# EAGLE design diy-ltcc (EAGLE 9.0.1)
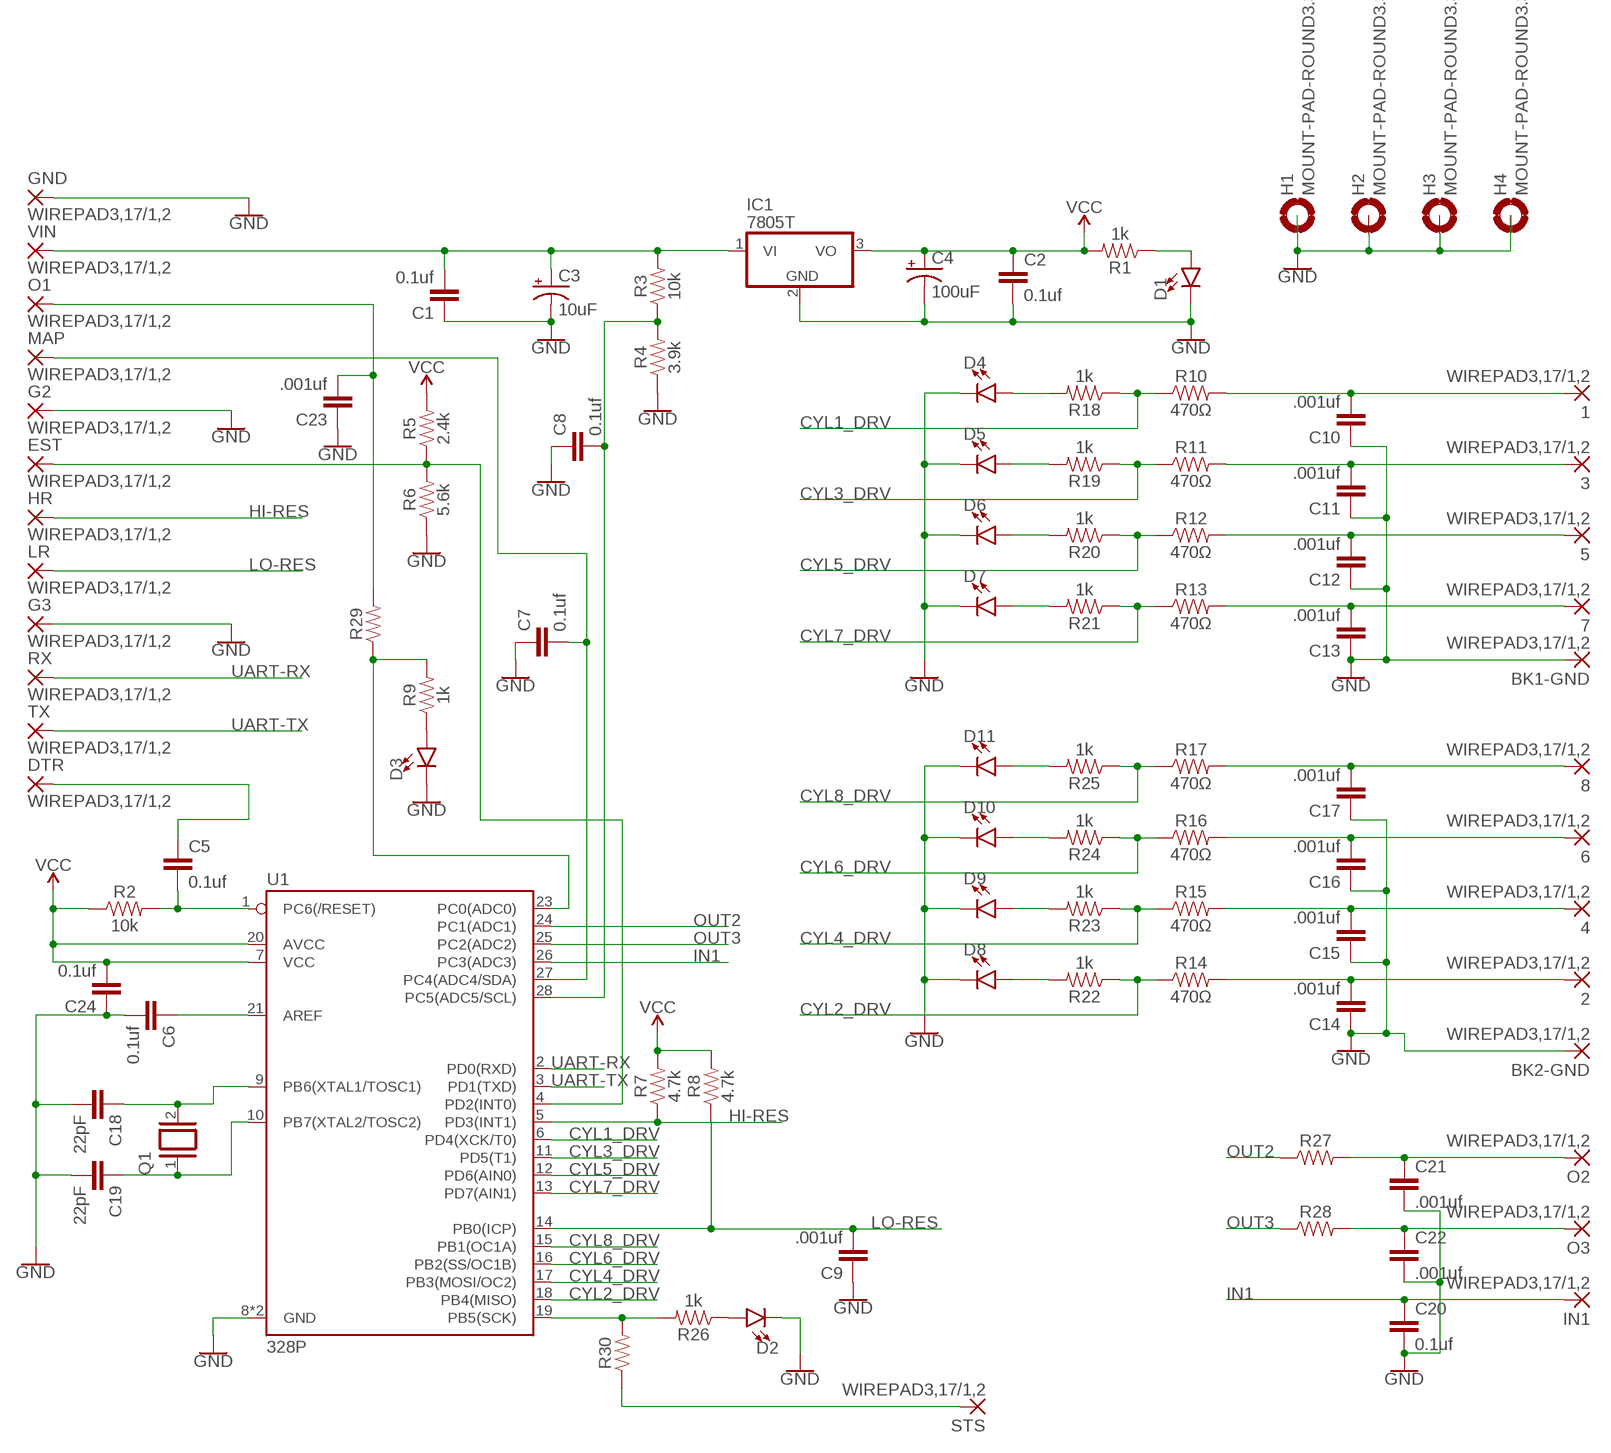
[diagram p0: schematic, sheet 1]

## Parts
1  WIREPAD3,17/1,2  [3,17/1,2]
2  WIREPAD3,17/1,2  [3,17/1,2]
3  WIREPAD3,17/1,2  [3,17/1,2]
4  WIREPAD3,17/1,2  [3,17/1,2]
5  WIREPAD3,17/1,2  [3,17/1,2]
6  WIREPAD3,17/1,2  [3,17/1,2]
7  WIREPAD3,17/1,2  [3,17/1,2]
8  WIREPAD3,17/1,2  [3,17/1,2]
BK1-GND  WIREPAD3,17/1,2  [3,17/1,2]
BK2-GND  WIREPAD3,17/1,2  [3,17/1,2]
C1  0.1uf  22PF-PTH-2.54MM-200V-5%  [CAP-PTH-2.54]
C2  0.1uf  22PF-PTH-2.54MM-200V-5%  [CAP-PTH-2.54]
C3  10uF  10UF-POLAR-RADIAL-2.5MM-KIT-25V-20%  [CPOL-RADIAL-2.5MM-5MM-KIT]
C4  100uF  100UF-POLAR-RADIAL-2.5MM-25V-20%  [CPOL-RADIAL-2.5MM-6.5MM]
C5  0.1uf  22PF-PTH-2.54MM-200V-5%  [CAP-PTH-2.54]
C6  0.1uf  22PF-PTH-2.54MM-200V-5%  [CAP-PTH-2.54]
C7  0.1uf  22PF-PTH-2.54MM-200V-5%  [CAP-PTH-2.54]
C8  0.1uf  22PF-PTH-2.54MM-200V-5%  [CAP-PTH-2.54]
C9  .001uf  22PF-PTH-2.54MM-200V-5%  [CAP-PTH-2.54]
C10  .001uf  22PF-PTH-2.54MM-200V-5%  [CAP-PTH-2.54]
C11  .001uf  22PF-PTH-2.54MM-200V-5%  [CAP-PTH-2.54]
C12  .001uf  22PF-PTH-2.54MM-200V-5%  [CAP-PTH-2.54]
C13  .001uf  22PF-PTH-2.54MM-200V-5%  [CAP-PTH-2.54]
C14  .001uf  22PF-PTH-2.54MM-200V-5%  [CAP-PTH-2.54]
C15  .001uf  22PF-PTH-2.54MM-200V-5%  [CAP-PTH-2.54]
C16  .001uf  22PF-PTH-2.54MM-200V-5%  [CAP-PTH-2.54]
C17  .001uf  22PF-PTH-2.54MM-200V-5%  [CAP-PTH-2.54]
C18  22pF  22PF-PTH-2.54MM-200V-5%  [CAP-PTH-2.54]
C19  22pF  22PF-PTH-2.54MM-200V-5%  [CAP-PTH-2.54]
C20  0.1uf  22PF-PTH-2.54MM-200V-5%  [CAP-PTH-2.54]
C21  .001uf  22PF-PTH-2.54MM-200V-5%  [CAP-PTH-2.54]
C22  .001uf  22PF-PTH-2.54MM-200V-5%  [CAP-PTH-2.54]
C23  .001uf  22PF-PTH-2.54MM-200V-5%  [CAP-PTH-2.54]
C24  0.1uf  22PF-PTH-2.54MM-200V-5%  [CAP-PTH-2.54]
D1  LED3MM  [LED_3MM]
D2  LED3MM  [LED_3MM]
D3  LED3MM  [LED_3MM]
D4  LED3MM  [LED_3MM]
D5  LED3MM  [LED_3MM]
D6  LED3MM  [LED_3MM]
D7  LED3MM  [LED_3MM]
D8  LED3MM  [LED_3MM]
D9  LED3MM  [LED_3MM]
D10  LED3MM  [LED_3MM]
D11  LED3MM  [LED_3MM]
DTR  WIREPAD3,17/1,2  [3,17/1,2]
EST  WIREPAD3,17/1,2  [3,17/1,2]
G2  WIREPAD3,17/1,2  [3,17/1,2]
G3  WIREPAD3,17/1,2  [3,17/1,2]
GND  WIREPAD3,17/1,2  [3,17/1,2]
H1  MOUNT-PAD-ROUND3.3  [3,3-PAD]
H2  MOUNT-PAD-ROUND3.3  [3,3-PAD]
H3  MOUNT-PAD-ROUND3.3  [3,3-PAD]
H4  MOUNT-PAD-ROUND3.3  [3,3-PAD]
HR  WIREPAD3,17/1,2  [3,17/1,2]
IC1  7805T  [TO220H]
IN1  WIREPAD3,17/1,2  [3,17/1,2]
LR  WIREPAD3,17/1,2  [3,17/1,2]
MAP  WIREPAD3,17/1,2  [3,17/1,2]
O1  WIREPAD3,17/1,2  [3,17/1,2]
O2  WIREPAD3,17/1,2  [3,17/1,2]
O3  WIREPAD3,17/1,2  [3,17/1,2]
Q1  XTAL/S  [QS]
R1  1k  1KOHM-HORIZ-1/4W-5%  [AXIAL-0.3]
R2  10k  10KOHM-HORIZ-1/4W-5%  [AXIAL-0.3]
R3  10k  10KOHM-HORIZ-1/4W-5%  [AXIAL-0.3]
R4  3.9k  10KOHM-HORIZ-1/4W-5%  [AXIAL-0.3]
R5  2.4k  1KOHM-HORIZ-1/4W-1%  [AXIAL-0.3]
R6  5.6k  1KOHM-HORIZ-1/4W-1%  [AXIAL-0.3]
R7  4.7k  10KOHM-HORIZ-1/4W-5%  [AXIAL-0.3]
R8  4.7k  10KOHM-HORIZ-1/4W-5%  [AXIAL-0.3]
R9  1k  1KOHM-HORIZ-1/4W-1%  [AXIAL-0.3]
R10  470Ω  1KOHM-HORIZ-1/4W-1%  [AXIAL-0.3]
R11  470Ω  1KOHM-HORIZ-1/4W-1%  [AXIAL-0.3]
R12  470Ω  1KOHM-HORIZ-1/4W-1%  [AXIAL-0.3]
R13  470Ω  1KOHM-HORIZ-1/4W-1%  [AXIAL-0.3]
R14  470Ω  1KOHM-HORIZ-1/4W-1%  [AXIAL-0.3]
R15  470Ω  1KOHM-HORIZ-1/4W-1%  [AXIAL-0.3]
R16  470Ω  1KOHM-HORIZ-1/4W-1%  [AXIAL-0.3]
R17  470Ω  1KOHM-HORIZ-1/4W-1%  [AXIAL-0.3]
R18  1k  1KOHM-HORIZ-1/4W-1%  [AXIAL-0.3]
R19  1k  1KOHM-HORIZ-1/4W-1%  [AXIAL-0.3]
R20  1k  1KOHM-HORIZ-1/4W-1%  [AXIAL-0.3]
R21  1k  1KOHM-HORIZ-1/4W-1%  [AXIAL-0.3]
R22  1k  1KOHM-HORIZ-1/4W-1%  [AXIAL-0.3]
R23  1k  1KOHM-HORIZ-1/4W-1%  [AXIAL-0.3]
R24  1k  1KOHM-HORIZ-1/4W-1%  [AXIAL-0.3]
R25  1k  1KOHM-HORIZ-1/4W-1%  [AXIAL-0.3]
R26  1k  1KOHM-HORIZ-1/4W-1%  [AXIAL-0.3]
R27  1KOHM-HORIZ-1/4W-1%  [AXIAL-0.3]
R28  1KOHM-HORIZ-1/4W-1%  [AXIAL-0.3]
R29  1KOHM-HORIZ-1/4W-1%  [AXIAL-0.3]
R30  1KOHM-HORIZ-1/4W-1%  [AXIAL-0.3]
RX  WIREPAD3,17/1,2  [3,17/1,2]
STS  WIREPAD3,17/1,2  [3,17/1,2]
TX  WIREPAD3,17/1,2  [3,17/1,2]
U1  328P  ATMEGA328P_PDIP  [DIP28]
VIN  WIREPAD3,17/1,2  [3,17/1,2]

## Nets
CYL1_DRV: R10.P$1 R18.P$1 U1.6(PD4(XCK/T0))
CYL2_DRV: R14.P$1 R22.P$1 U1.18(PB4(MISO))
CYL3_DRV: R11.P$1 R19.P$1 U1.11(PD5(T1))
CYL4_DRV: R15.P$1 R23.P$1 U1.17(PB3(MOSI/OC2))
CYL5_DRV: R12.P$1 R20.P$1 U1.12(PD6(AIN0))
CYL6_DRV: R16.P$1 R24.P$1 U1.16(PB2(SS/OC1B))
CYL7_DRV: R13.P$1 R21.P$1 U1.13(PD7(AIN1))
CYL8_DRV: R17.P$1 R25.P$1 U1.15(PB1(OC1A))
DTR: C5.1 DTR.1(P)
GND: BK1-GND.1(P) BK2-GND.1(P) C1.1 C2.2 C3.2(-) C4.2(-) C6.2 C7.1 C8.1 C9.1 C10.1 C11.1 C12.1 C13.1 C14.1 C15.1 C16.1 C17.1 C18.2 C19.2 C20.2 C21.2 C22.2 C23.1 C24.1 D1.K(C) D2.K(C) D3.K(C) D4.K(C) D5.K(C) D6.K(C) D7.K(C) D8.K(C) D9.K(C) D10.K(C) D11.K(C) G2.1(P) G3.1(P) GND.1(P) H1.B3,3(MOUNT) H2.B3,3(MOUNT) H3.B3,3(MOUNT) H4.B3,3(MOUNT) IC1.2(GND) R4.P$1 R6.P$1 U1.8(GND) U1.22(GND)
HI-RES: HR.1(P) R7.P$1 U1.5(PD3(INT1))
IN1: C20.1 IN1.1(P) U1.26(PC3(ADC3))
LO-RES: C9.2 LR.1(P) R8.P$1 U1.14(PB0(ICP))
N$1: D1.A R1.P$1
N$2: C5.2 R2.P$2 U1.1(PC6(/RESET))
N$3: C6.1 U1.21(AREF)
N$4: C8.2 R3.P$1 R4.P$2 U1.28(PC5(ADC5/SCL))
N$5: C1.2 C3.1(+) IC1.1(VI) R3.P$2 VIN.1(P)
N$6: C7.2 MAP.1(P) U1.27(PC4(ADC4/SDA))
N$7: EST.1(P) R5.P$1 R6.P$2 U1.4(PD2(INT0))
N$8: R9.P$2 R29.P$1 U1.23(PC0(ADC0))
N$9: D3.A R9.P$1
N$10: 7.1(P) C13.2 R13.P$2
N$11: 5.1(P) C12.2 R12.P$2
N$12: 3.1(P) C11.2 R11.P$2
N$13: 1.1(P) C10.2 R10.P$2
N$14: D2.A R26.P$1
N$15: 8.1(P) C17.2 R17.P$2
N$16: 6.1(P) C16.2 R16.P$2
N$17: 4.1(P) C15.2 R15.P$2
N$18: 2.1(P) C14.2 R14.P$2
N$19: R26.P$2 R30.P$2 U1.19(PB5(SCK))
N$20: D8.A R22.P$2
N$21: D9.A R23.P$2
N$22: D10.A R24.P$2
N$23: D11.A R25.P$2
N$24: D7.A R21.P$2
N$25: D6.A R20.P$2
N$26: D5.A R19.P$2
N$27: D4.A R18.P$2
N$28: C18.1 Q1.2 U1.9(PB6(XTAL1/TOSC1))
N$29: C19.1 Q1.1 U1.10(PB7(XTAL2/TOSC2))
N$30: C23.2 O1.1(P) R29.P$2
N$31: C22.1 O3.1(P) R28.P$2
N$32: C21.1 O2.1(P) R27.P$2
N$33: R30.P$1 STS.1(P)
OUT2: R27.P$1 U1.24(PC1(ADC1))
OUT3: R28.P$1 U1.25(PC2(ADC2))
UART-RX: RX.1(P) U1.2(PD0(RXD))
UART-TX: TX.1(P) U1.3(PD1(TXD))
VCC: C2.1 C4.1(+) C24.2 IC1.3(VO) R1.P$2 R2.P$1 R5.P$2 R7.P$2 R8.P$2 U1.7(VCC) U1.20(AVCC)

## Library data of the parts
1-8 BK1-GND BK2-GND DTR EST G2 G3 GND HR IN1 LR MAP O1-O3 RX STS TX VIN = wirepad:WIREPAD: Wire PAD connect wire on PCB
C1 C2 C5-C17 C20-C24 = SparkFun-Capacitors:22PF: 22pF ceramic capacitors A capacitor is a passive two-terminal electrical component used to store electrical energy temporarily in an electric field.; PROD_ID: CAP-09128; VALUE: 22pF
C3 = SparkFun-Capacitors:10UF-POLAR: 10.0µF polarized capacitors A capacitor is a passive two-terminal electrical component used to store electrical energy temporarily in an electric field.; PROD_ID: CAP-08440
C4 = SparkFun-Capacitors:100UF-POLAR: 100µF polarized capacitors A capacitor is a passive two-terminal electrical component used to store electrical energy temporarily in an electric field.; PROD_ID: CAP-08439
C18 C19 = SparkFun-Capacitors:22PF: 22pF ceramic capacitors A capacitor is a passive two-terminal electrical component used to store electrical energy temporarily in an electric field.; PROD_ID: CAP-09128
D1-D11 = SparkFun-LED:LED: LED (Generic) Standard schematic elements and footprints for 5mm, 3mm, 1206, and 0603 sized LEDs. Generic LEDs with no color specified.; PROD_ID: DIO-08794
H1-H4 = holes:MOUNT-PAD-ROUND: MOUNTING PAD, round
IC1 = linear:78*: Positive VOLTAGE REGULATOR Source: http://cache.national.com/ds/LM/LM78L05.pdf http://www.fairchildsemi.com/ds/LM/LM7805.pdf
Q1 = special:XTAL/S: CRYSTAL
R1 = SparkFun-Resistors:1KOHM: 1kΩ resistor A resistor is a passive two-terminal electrical component that implements electrical resistance as a circuit element. Resistors act to reduce current flow, and, at the same time, act to lower voltage levels within circuits. - Wikipedia; PROD_ID: RES-08380
R2 R3 = SparkFun-Resistors:10KOHM: 10kΩ resistor A resistor is a passive two-terminal electrical component that implements electrical resistance as a circuit element. Resistors act to reduce current flow, and, at the same time, act to lower voltage levels within circuits. - Wikipedia; PROD_ID: RES-09435
R4 R7 R8 = SparkFun-Resistors:10KOHM: 10kΩ resistor A resistor is a passive two-terminal electrical component that implements electrical resistance as a circuit element. Resistors act to reduce current flow, and, at the same time, act to lower voltage levels within circuits. - Wikipedia; PROD_ID: RES-09435; VALUE: 10k
R5 R6 R10-R17 R27-R30 = SparkFun-Resistors:1KOHM: 1kΩ resistor A resistor is a passive two-terminal electrical component that implements electrical resistance as a circuit element. Resistors act to reduce current flow, and, at the same time, act to lower voltage levels within circuits. - Wikipedia; PROD_ID: RES-12182; VALUE: 1k
R9 R18-R26 = SparkFun-Resistors:1KOHM: 1kΩ resistor A resistor is a passive two-terminal electrical component that implements electrical resistance as a circuit element. Resistors act to reduce current flow, and, at the same time, act to lower voltage levels within circuits. - Wikipedia; PROD_ID: RES-12182
U1 = SparkFun-IC-Microcontroller:ATMEGA328P_PDIP: Atmel 328P Through hole ATMEGA328P uC used in the Arduino 32kb flash, 1k EEPROM, 2k SRAM Datasheet <http://www.sparkfun.com/datasheets/Components/SMD/ATMega328.pdf> SparkFun Products Storefront component: AVR 28 Pin 20MHz 32K 6A/D - ATMega328P <https://www.sparkfun.com/products/9061> (COM-09061) SparkFun Simon Says - Through-Hole Soldering Kit <https://www.sparkfun.com/products/10547> (KIT-10547) SparkFun Learn to Solder - Simon Says <https://www.sparkfun.com/products/13708> (KIT-13708) SparkFun BigTime Watch Kit <https://www.sparkfun.com/products/11734> (KIT-11734) SparkFun ClockIt <https://www.sparkfun.com/products/10930> (KIT-10930) SparkFun Serial Enabled LCD Kit <https://www.sparkfun.com/products/10097> (LCD-10097) SparkFun Simon Tilts - Through Hole Soldering Kit <https://www.sparkfun.com/products/12634> (KIT-12634) SparkFun Frequency Counter Kit <https://www.sparkfun.com/products/10140> (KIT-10140) FabFM Radio Kit <https://www.sparkfun.com/products/11043> (KIT-11043) SparkFun Binary Blaster Kit <https://www.sparkfun.com/products/12037> (KIT-12037) SparkFun Metro-Gnome <https://www.sparkfun.com/products/9236> (KIT-09236) ATmega328 with Arduino Optiboot (Uno) <https://www.sparkfun.com/products/10524> (DEV-10524); PROD_ID: IC-09136

## Board
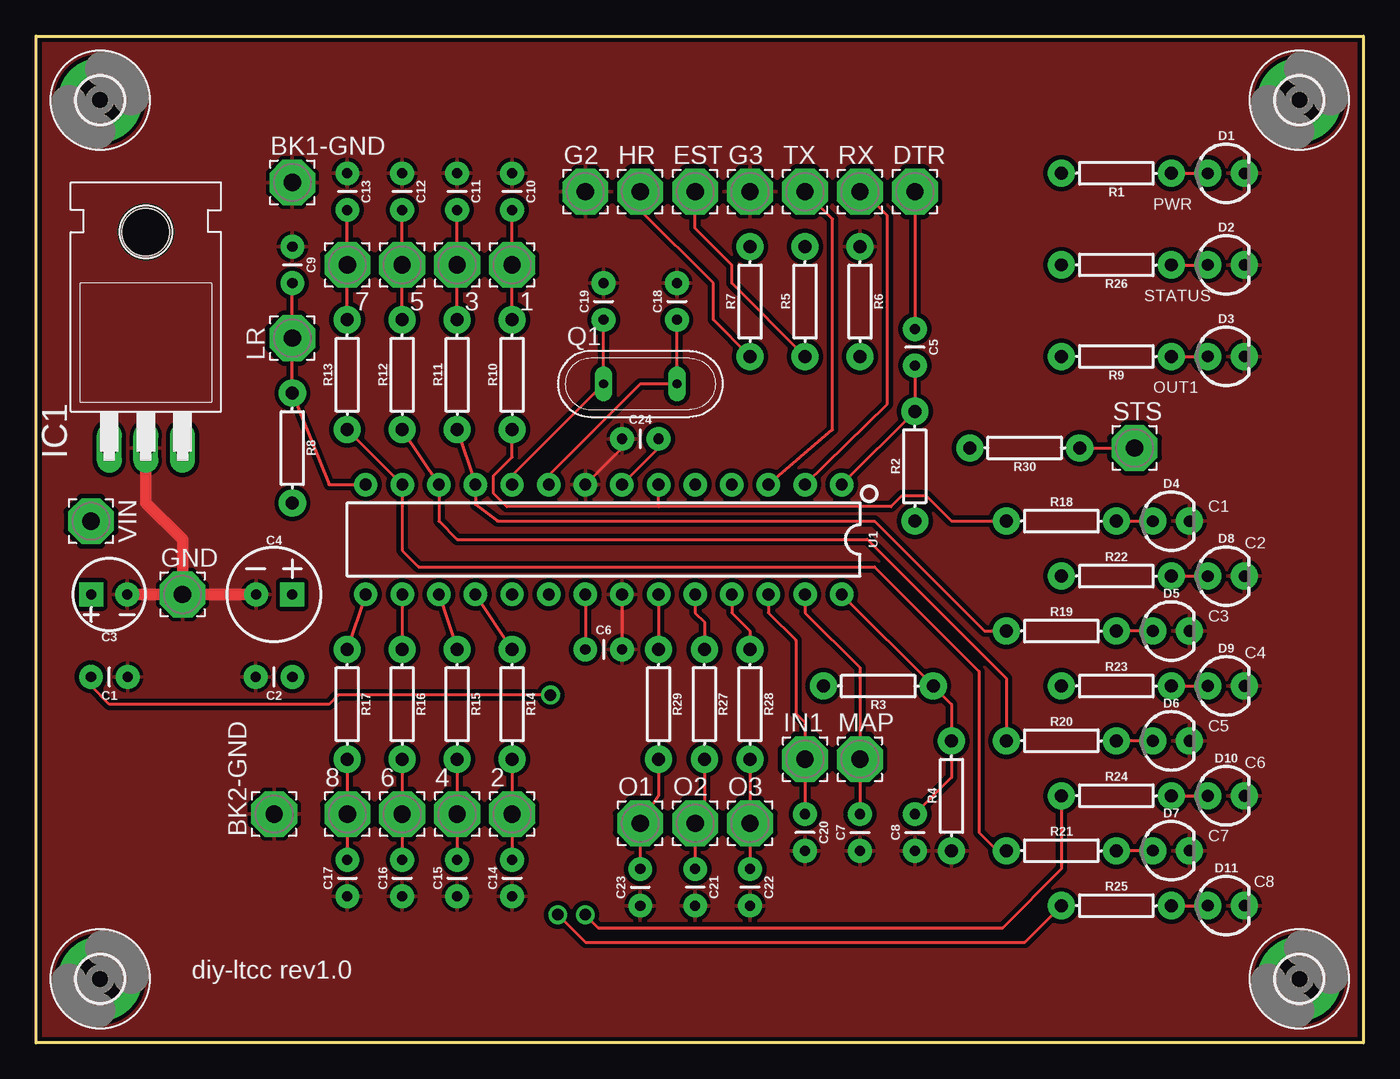
[diagram p1: board, top side]
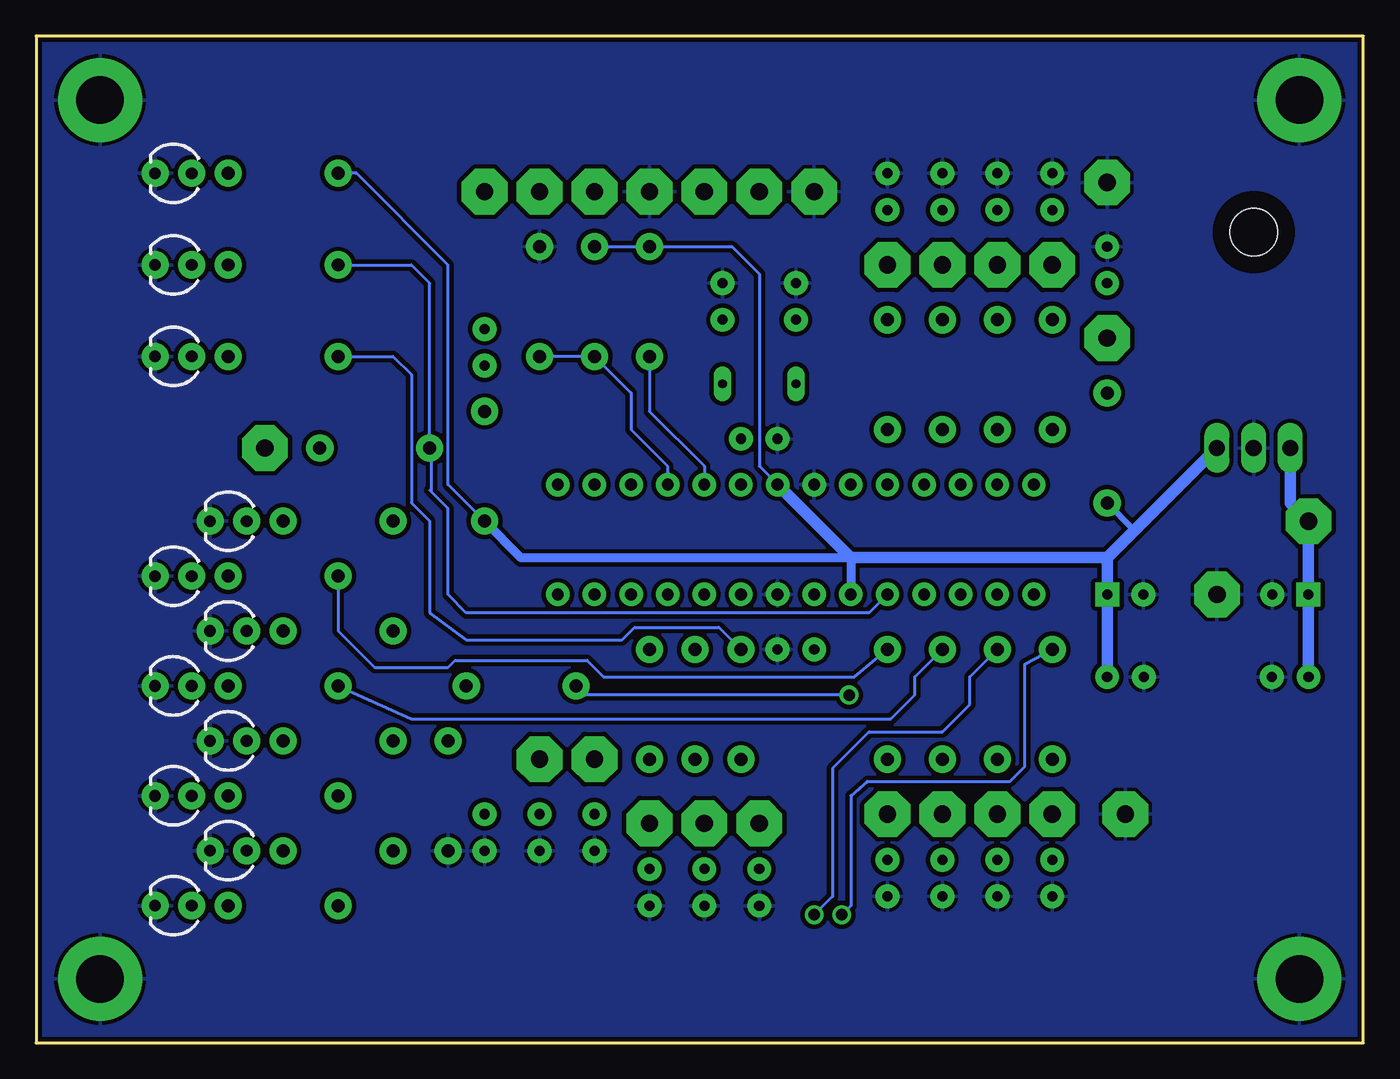
[diagram p2: board, bottom side, seen from below]

Size 92.08 x 69.85 mm. Coordinates in mm from the lower left corner, seen from the top.
Outline: 0,0 0,69.85 92.08,69.85 92.08,0 0,0
Copper layers (1*16): Top 0.035mm / dielectric 1.5mm / Bottom 0.035mm
Design rules "SparkFun": minimum track width 8mil, minimum drill 20mil, track to track 8mil, track to pad 8mil, pad to pad 8mil, via to via 8mil, smd to smd 8mil, copper to edge 8mil, drill to drill 8mil, minimum pad ring 12mil, minimum via ring 10mil, stop-mask expansion 4mil, vias tented up to drill 20mil, thermal gap 10mil

### Footprints (pad centres in the part's own frame; a part is rotated, then mirrored left to right if it is on the bottom)
3,17/1,2 = drill 1.194 pad 3.175 octagon: 1 0,0
CAP-PTH-2.54 = drill 0.7 pad 1.651: 1 -1.27,0; 2 1.27,0
CPOL-RADIAL-2.5MM-5MM-KIT = drill 0.7 pad 1.651 square: 1 1.25,0 | drill 0.7 pad 1.651: 2 -1.25,0
CPOL-RADIAL-2.5MM-6.5MM = drill 0.7 pad 1.651 square: 1 1.25,0 | drill 0.7 pad 1.651: 2 -1.25,0
LED_3MM = drill 0.813 pad 1.88: A -1.27,0; K 1.27,0
3,3-PAD = drill 3.3 pad 5.842: B3,3 0,0
TO220H = drill 1.118 long: 1 -2.54,-10.16; 2 0,-10.16; 3 2.54,-10.16 | hole 3.302: 0,4.826
QS = drill 0.61 long: 1 -2.54,0; 2 2.54,0
AXIAL-0.3 = drill 0.9 pad 1.88: P$1 -3.81,0; P$2 3.81,0
DIP28 = drill 0.813 pad 1.626: 1 -16.51,-3.81; 2 -13.97,-3.81; 3 -11.43,-3.81; 4 -8.89,-3.81; 5 -6.35,-3.81; 6 -3.81,-3.81; 7 -1.27,-3.81; 8 1.27,-3.81; 9 3.81,-3.81; 10 6.35,-3.81; 11 8.89,-3.81; 12 11.43,-3.81; 13 13.97,-3.81; 14 16.51,-3.81; 15 16.51,3.81; 16 13.97,3.81; 17 11.43,3.81; 18 8.89,3.81; 19 6.35,3.81; 20 3.81,3.81; 21 1.27,3.81; 22 -1.27,3.81; 23 -3.81,3.81; 24 -6.35,3.81; 25 -8.89,3.81; 26 -11.43,3.81; 27 -13.97,3.81; 28 -16.51,3.81

### Placement (x,y rotation side)
1  33.02,53.98 180 top
2  33.02,15.88 0 top
3  29.21,53.98 180 top
4  29.21,15.88 0 top
5  25.4,53.98 180 top
6  25.4,15.88 0 top
7  21.59,53.98 180 top
8  21.59,15.88 0 top
BK1-GND  17.78,59.69 0 top
BK2-GND  16.51,15.88 90 top
C1  5.08,25.4 180 top
C2  16.51,25.4 180 top
C3  5.08,31.11 180 top
C4  16.51,31.11 0 top
C5  60.96,48.26 270 top
C6  39.37,27.3 0 top
C7  57.15,14.61 90 top
C8  60.96,14.61 90 top
C9  17.78,53.98 270 top
C10  33.02,59.05 270 top
C11  29.21,59.05 270 top
C12  25.4,59.05 270 top
C13  21.59,59.05 270 top
C14  33.02,11.43 90 top
C15  29.21,11.43 90 top
C16  25.4,11.43 90 top
C17  21.59,11.43 90 top
C18  44.45,51.44 90 top
C19  39.37,51.44 90 top
C20  53.34,14.61 270 top
C21  45.72,10.79 270 top
C22  49.53,10.79 270 top
C23  41.91,10.79 90 top
C24  41.91,41.91 0 top
D1  82.55,60.33 0 top
D2  82.55,53.98 0 top
D3  82.55,47.62 0 top
D4  78.74,36.2 0 top
D5  78.74,28.57 0 top
D6  78.74,20.95 0 top
D7  78.74,13.34 0 top
D8  82.55,32.38 0 top
D9  82.55,24.77 0 top
D10  82.55,17.14 0 top
D11  82.55,9.53 0 top
DTR  60.96,59.05 0 top
EST  45.72,59.05 0 top
G2  38.1,59.05 0 top
G3  49.53,59.05 0 top
GND  10.16,31.11 0 top
H1  4.45,4.45 0 top
H2  4.45,65.41 0 top
H3  87.63,65.41 0 top
H4  87.63,4.45 0 top
HR  41.91,59.05 0 top
IC1  7.62,51.44 0 top
IN1  53.34,19.68 0 top
LR  17.78,48.9 90 top
MAP  57.15,19.68 0 top
O1  41.91,15.24 0 top
O2  45.72,15.24 0 top
O3  49.53,15.24 0 top
Q1  41.91,45.72 0 top
R1  74.93,60.33 180 top
R2  60.96,40.01 90 top
R3  58.42,24.77 180 top
R4  63.5,17.14 90 top
R5  53.34,51.44 90 top
R6  57.15,51.44 270 top
R7  49.53,51.44 90 top
R8  17.78,41.27 270 top
R9  74.93,47.62 180 top
R10  33.02,46.35 90 top
R11  29.21,46.35 90 top
R12  25.4,46.35 90 top
R13  21.59,46.35 90 top
R14  33.02,23.5 270 top
R15  29.21,23.5 270 top
R16  25.4,23.5 270 top
R17  21.59,23.5 270 top
R18  71.12,36.2 0 top
R19  71.12,28.57 0 top
R20  71.12,20.95 0 top
R21  71.12,13.34 0 top
R22  74.93,32.38 0 top
R23  74.93,24.77 0 top
R24  74.93,17.14 0 top
R25  74.93,9.53 0 top
R26  74.93,53.98 180 top
R27  46.35,23.5 270 top
R28  49.53,23.5 270 top
R29  43.18,23.5 270 top
R30  68.58,41.27 180 top
RX  57.15,59.05 0 top
STS  76.2,41.27 0 top
TX  53.34,59.05 0 top
U1  39.37,34.92 180 top
VIN  3.81,36.2 270 top

### Tracks (layer width: path | path; a pad name or v marks a point on that pad's centre or on a via)
CYL1_DRV
  Top 0.203: 43.18,37.21 U1.6 | 43.18,37.21 59.31,37.21 60.07,37.97 61.72,37.97 63.5,36.2 R18.P$1 | 43.18,37.21 32.64,37.21 31.75,38.1 31.75,39.37 33.02,40.64 R10.P$1
CYL2_DRV
  Top 0.203: U1.18 R14.P$1
  Bottom 0.203: R22.P$1 71.12,28.57 68.58,26.04 63.5,26.04 62.99,26.54 53.85,26.54 52.7,25.4 35.31,25.4 R14.P$1
CYL3_DRV
  Top 0.203: R11.P$1 U1.11 30.48,37.34 32,36.2 58.17,36.2 65.79,28.57 R19.P$1
CYL4_DRV
  Top 0.203: U1.17 R15.P$1
  Bottom 0.203: R23.P$1 66.04,22.48 32.77,22.48 31.11,24.13 31.11,25.4 R15.P$1
CYL5_DRV
  Top 0.203: R12.P$1 U1.12 27.94,36.2 29.21,34.92 57.66,34.92 67.31,25.27 R20.P$1
CYL6_DRV  (via drill 0.8)
  Top 0.203: U1.16 R16.P$1 | R24.P$1 71.12,12.06 67.06,8 38.99,8 v38.1,8.89
  Bottom 0.203: v38.1,8.89 36.83,10.16 36.83,19.05 34.29,21.59 29.21,21.59 27.3,23.5 27.3,25.4 R16.P$1
CYL7_DRV
  Top 0.203: R13.P$1 U1.13 25.4,34.16 26.54,33.02 58.17,33.02 65.41,25.78 65.41,14.61 66.67,13.34 R21.P$1
CYL8_DRV  (via drill 0.8)
  Top 0.203: U1.15 R17.P$1 | v36.2,8.89 38.1,6.99 68.58,6.99 R25.P$1
  Bottom 0.203: R17.P$1 23.5,26.29 23.5,19.18 24.51,18.16 34.42,18.16 35.56,17.14 35.56,9.53 v36.2,8.89
DTR
  Top 0.203: DTR.1 C5.1
GND
  Top 0.203: U1.22 C6.2 | U1.8 40.64,41.27 C24.1
  Top 0.813: IC1.2 7.62,37.47 10.16,34.92 GND.1 | C4.2 GND.1 | GND.1 C3.2
  pour Bottom (isolate 0.305): 0,69.85 92.08,69.85 92.08,0 0,0
  pour Top (isolate 0.305): 0,69.85 92.08,69.85 92.08,0 0,0
HI-RES
  Top 0.203: R7.P$1 46.99,50.16 46.99,52.7 41.91,57.78 HR.1
  Bottom 0.203: R7.P$1 49.53,43.81 45.72,40.01 U1.5
IN1
  Top 0.203: C20.1 IN1.1 53.34,22.23 52.7,22.86 52.7,27.94 50.8,29.84 U1.26
LO-RES
  Top 0.203: U1.14 20.32,38.73 R8.P$1 LR.1 C9.2
N$1
  Top 0.203: R1.P$1 D1.A
N$2
  Top 0.203: C5.2 R2.P$2 U1.1
N$3
  Top 0.203: U1.21 C6.1
N$4
  Top 0.203: U1.28 R3.P$1 63.5,23.5 R4.P$2 63.5,18.41 C8.2 60.83,16
N$5  (via drill 0.8)
  Top 0.203: C1.2 3.81,24.77 5.08,23.5 20.32,23.5 20.95,24.13 35.56,24.13 v35.69,24.13 | 3.81,31.09 C3.1
  Bottom 0.203: v35.69,24.13 53.98,24.13 R3.P$2
  Bottom 0.406: 3.82,31.12 C3.1
  Bottom 0.813: IC1.1 5.08,37.47 VIN.1 3.81,31.14 3.82,31.12 | C3.1 3.83,25.42 C1.2
N$6
  Top 0.203: C7.2 MAP.1 57.15,26.04 53.34,29.84 U1.27
N$7
  Top 0.203: R5.P$1 48.26,52.7 48.26,53.98 45.72,56.52 EST.1
  Bottom 0.203: R6.P$2 R5.P$1 50.8,45.09 50.8,42.55 48.26,40.01 U1.4
N$8
  Top 0.203: U1.23 R29.P$1
  Bottom 0.203: R9.P$2 67.31,47.62 66.04,46.35 66.04,37.47 64.77,36.2 64.77,29.84 62.23,27.94 51.44,27.94 50.55,28.83 44.7,28.83 R29.P$1
N$9
  Top 0.203: R9.P$1 D3.A
N$10
  Top 0.203: R13.P$2 7.1 C13.2
N$11
  Top 0.203: R12.P$2 5.1 C12.2
N$12
  Top 0.203: R11.P$2 3.1 C11.2
N$13
  Top 0.203: R10.P$2 1.1 C10.2
N$14
  Top 0.203: R26.P$1 D2.A
N$15
  Top 0.203: R17.P$2 8.1 C17.2
N$16
  Top 0.203: R16.P$2 6.1 C16.2
N$17
  Top 0.203: R15.P$2 4.1 C15.2
N$18
  Top 0.203: R14.P$2 2.1 C14.2
N$19
  Bottom 0.203: R26.P$2 66.04,53.98 64.77,52.7 R30.P$2 64.64,41.15 64.64,38.23 | 64.77,38.35 64.64,38.23 | 64.64,38.23 63.5,37.08 63.5,31.11 62.23,29.84 34.29,29.84 U1.19
N$20
  Top 0.203: R22.P$2 D8.A
N$21
  Top 0.203: R23.P$2 D9.A
N$22
  Top 0.203: R24.P$2 D10.A
N$23
  Top 0.203: R25.P$2 D11.A
N$24
  Top 0.203: D7.A R21.P$2
N$25
  Top 0.203: D6.A R20.P$2
N$26
  Top 0.203: D5.A R19.P$2
N$27
  Top 0.203: R18.P$2 D4.A
N$28
  Top 0.203: C18.1 Q1.2 41.91,45.72 35.56,39.37 U1.9
N$29
  Top 0.203: C19.1 Q1.1 33.02,39.37 U1.10
N$30
  Top 0.203: R29.P$2 43.18,17.14 O1.1 C23.2
N$31
  Top 0.203: R28.P$2 O3.1 C22.1
N$32
  Top 0.203: R27.P$2 46.35,16.51 O2.1 C21.1
N$33
  Top 0.203: R30.P$1 STS.1
OUT2
  Top 0.203: U1.24 45.72,29.84 46.35,29.21 R27.P$1
OUT3
  Top 0.203: U1.25 48.26,29.84 49.53,28.57 R28.P$1
UART-RX
  Top 0.203: U1.2 59.05,44.32 59.05,57.4 57.4,59.05 RX.1
UART-TX
  Top 0.203: U1.3 55.24,42.55 55.24,57.15 TX.1
VCC
  Top 0.203: U1.7 43.18,41.27 C24.2
  Bottom 0.203: R2.P$1 63.5,38.73 63.5,53.98 69.85,60.33 R1.P$2 | R5.P$2 R7.P$2 43.81,55.24 41.91,53.34 41.91,40.01 U1.7
  Bottom 0.406: 15.88,35.56 R8.P$2
  Bottom 0.61: 35.56,33.66 58.42,33.66 R2.P$1 | 35.54,33.67 35.54,31.14 U1.20
  Bottom 0.813: IC1.3 15.88,35.56 17.76,33.67 | 17.76,33.67 C4.1 17.78,31.09 C2.1 | 17.76,33.67 35.54,33.67 35.56,33.66 U1.7

### Text on the board
tPlace: PWR | STATUS | OUT1 | C1 | C2 | C3 | C4 | C5 | C6 | C7 | C8 | diy-ltcc rev1.0